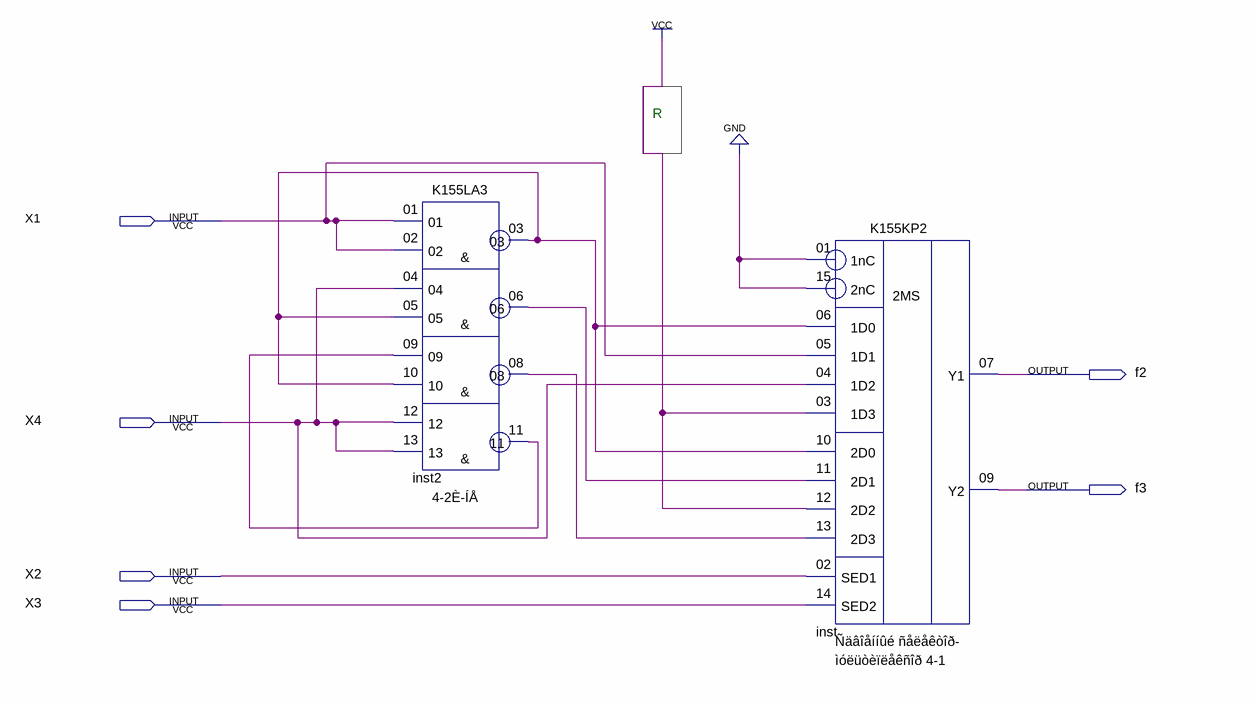
[diagram p0: schematic sheet]
// Quartus schematic lab1.bdf as structural Verilog: 2 symbols, 6 pins
module lab1 (
  input  X1,
  input  X4,
  input  X2,
  input  X3,
  output f2,
  output f3
);

  wire inst2_03, inst2_06, inst2_08, inst2_11;

  K155LA3 inst2 (
    .\01 (X1), .\02 (X1), .\04 (X4), .\05 (inst2_03), .\09 (inst2_11), .\10 (inst2_03), .\12 (X4), .\13 (X4),
    .\03 (inst2_03), .\06 (inst2_06), .\08 (inst2_08), .\11 (inst2_11));
  K155KP2 inst (
    .\1nC (1'b0), .\1D0 (inst2_03), .\1D1 (X1), .\1D2 (X4), .\1D3 (1'b1), .SED2(X3), .SED1(X2),
    .\2D0 (inst2_03), .\2D1 (inst2_06), .\2D2 (1'b1), .\2D3 (inst2_08), .\2nC (1'b0), .Y1(f2), .Y2(f3));

  // Notes on the sheet:
  //   R
endmodule
